# Altium project 2nd PCB.PrjPcb
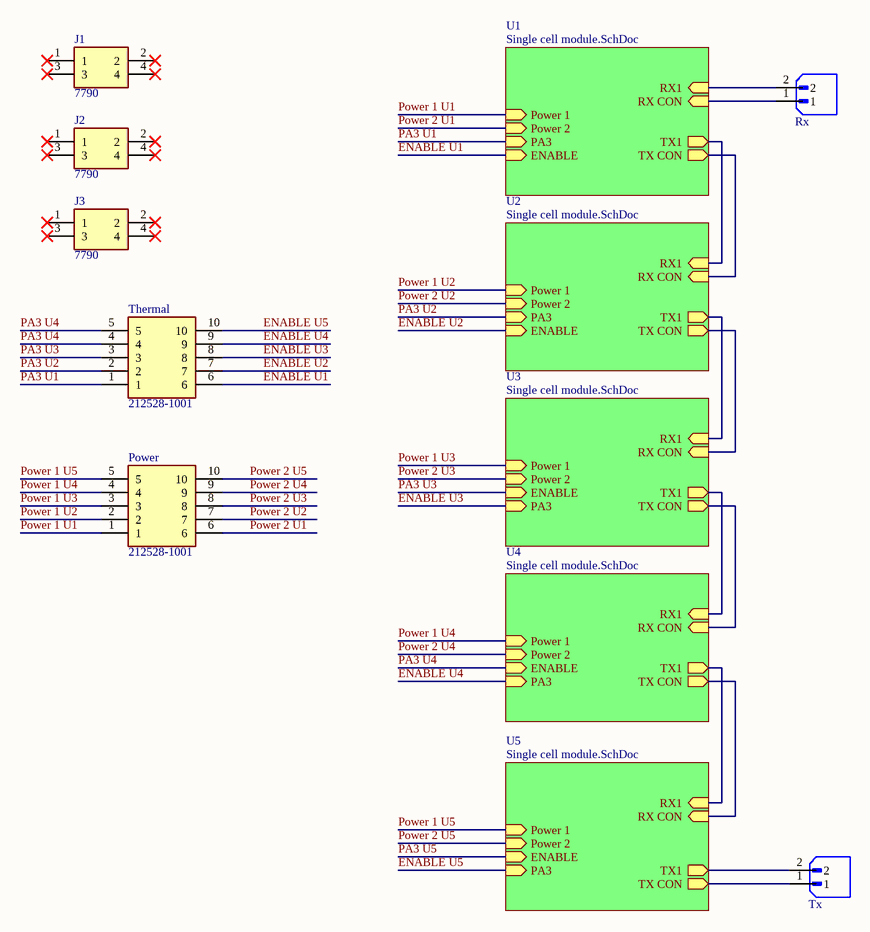
[diagram p0: Five cell modules.SchDoc]
2 sheets, 167 parts. Net scope: hierarchical (ports join the sheet entries above them; power ports are global).
Board file: PCB2.PcbDoc
Sheets:
  Five cell modules.SchDoc
    U3 = Single cell module.SchDoc
    U4 = Single cell module.SchDoc
    U5 = Single cell module.SchDoc
    U1 = Single cell module.SchDoc
    U2 = Single cell module.SchDoc

## Sheet Five cell modules.SchDoc
size A4; SheetNumber: 1; SheetTotal: 2

### Parts
J1  7790  [7790]
J2  7790  [7790]
J3  7790  [7790]
Power  212528-1001  [212528-10YY_1]
Rx  B2B-XH-A(LF)(SN)  [JST_B2B-XH-A(LF)(SN)]  (value not drawn)
Thermal  212528-1001  [212528-10YY_1]
Tx  B2B-XH-A(LF)(SN)  [JST_B2B-XH-A(LF)(SN)]  (value not drawn)

### Sub-sheets
U1 = Single cell module.SchDoc: TX1 (out), TX CON (out), RX1 (in), RX CON (in), Power 1 (in), Power 2 (in), PA3 (in), ENABLE (in)
U2 = Single cell module.SchDoc: TX1 (out), TX CON (out), RX1 (in), RX CON (in), Power 1 (in), Power 2 (in), PA3 (in), ENABLE (in)
U3 = Single cell module.SchDoc: TX1 (out), TX CON (out), RX1 (in), RX CON (in), Power 1 (in), Power 2 (in), ENABLE (in), PA3 (in)
U4 = Single cell module.SchDoc: TX1 (out), TX CON (out), RX1 (in), RX CON (in), Power 1 (in), Power 2 (in), ENABLE (in), PA3 (in)
U5 = Single cell module.SchDoc: TX1 (out), TX CON (out), RX1 (in), RX CON (in), Power 1 (in), Power 2 (in), ENABLE (in), PA3 (in)

### Nets
Power 1 U1: Power.1 Power.2 Power.3 Power.4 Power.5 ; sheet U3/Power 1, sheet U4/Power 1, sheet U5/Power 1, sheet U1/Power 1, sheet U2/Power 1  [also labelled Power 1 U2, Power 1 U3, Power 1 U4, Power 1 U5]
VCC: Rx.2 ; sheet U3/TX1, sheet U3/RX1, sheet U4/TX1, sheet U4/RX1, sheet U5/RX1, sheet U1/TX1, sheet U1/RX1, sheet U2/TX1, sheet U2/RX1
ENABLE U1: Thermal.6 ; sheet U1/ENABLE
ENABLE U2: Thermal.7 ; sheet U2/ENABLE
ENABLE U3: Thermal.8 ; sheet U3/PA3
ENABLE U4: Thermal.9 ; sheet U4/PA3
ENABLE U5: Thermal.10 ; sheet U5/PA3
PA3 U1: Thermal.1 ; sheet U1/PA3
PA3 U2: Thermal.2 ; sheet U2/PA3
PA3 U3: Thermal.3 ; sheet U3/ENABLE
PA3 U4: Thermal.4 Thermal.5 ; sheet U4/ENABLE
PA3 U5: sheet U5/ENABLE
Power 2 U1: Power.6 ; sheet U1/Power 2
Power 2 U2: Power.7 ; sheet U2/Power 2
Power 2 U3: Power.8 ; sheet U3/Power 2
Power 2 U4: Power.9 ; sheet U4/Power 2
Power 2 U5: Power.10 ; sheet U5/Power 2
RXDO: Rx.1 ; sheet U1/RX CON
RXDO: sheet U3/RX CON, sheet U2/TX CON  [a separate net that carries the same name]
RXDO: sheet U3/TX CON, sheet U4/RX CON  [a separate net that carries the same name]
RXDO: sheet U4/TX CON, sheet U5/RX CON  [a separate net that carries the same name]
RXDO: sheet U1/TX CON, sheet U2/RX CON  [a separate net that carries the same name]
NetTx_1: Tx.1 ; sheet U5/TX CON
NetTx_2: Tx.2 ; sheet U5/TX1

Not connected (* = marked no-connect by the designer): J1 1* 2* 3* 4*; J2 1* 2* 3* 4*; J3 1* 2* 3* 4*

### Library data of the parts
J1-J3 = 7790: Connector; Manufacturer_Name: Keystone Electronics; Datasheet Link: https://www.digikey.co.uk/product-detail/en/keystone-electronics/7790/36-7790-ND/2171010; Height: 7.9mm; Manufacturer_Part_Number: 7790; Mouser Part Number: 534-7790; Mouser Price/Stock: https://www.mouser.co.uk/ProductDetail/Keystone-Electronics/7790?qs=zBlGwAMnvtdjBTIaaitQnQ%3D%3D; Arrow Part Number: 7790; Arrow Price/Stock: https://www.arrow.com/en/products/7790/keystone-electronics?region=europe
Power Thermal = 212528-1001: Connector; Manufacturer_Name: Molex; Datasheet Link: https://www.molex.com/pdm_docs/sd/2125280200_sd.pdf; Height: 8.8mm; Manufacturer_Part_Number: 212528-1001; Mouser Part Number: 538-212528-1001; Mouser Price/Stock: https://www.mouser.co.uk/ProductDetail/Molex/212528-1001?qs=W%2FMpXkg%252BdQ4hWZ2b%252Bpt5GQ%3D%3D
Rx Tx = B2B-XH-A(LF)(SN): Connector Header Through Hole 2 position 0.098 (2.50mm); MF: JST Sales America Inc.; SnapEDA_Link: https://www.snapeda.com/parts/B2B-XH-A(LF)(SN)/JST+Sales+America+Inc./view-part/?ref=snap; Package: None; Value: *; MP: B2B-XH-A(LF)(SN); Check_prices: https://www.snapeda.com/parts/B2B-XH-A(LF)(SN)/JST+Sales+America+Inc./view-part/?ref=eda

## Sheet Single cell module.SchDoc
size A4; SheetNumber: 2; SheetTotal: 2
Used 5 times, as channels U3, U4, U5, U1, U2. Parts and nets are listed once, with the designators drawn on the sheet.
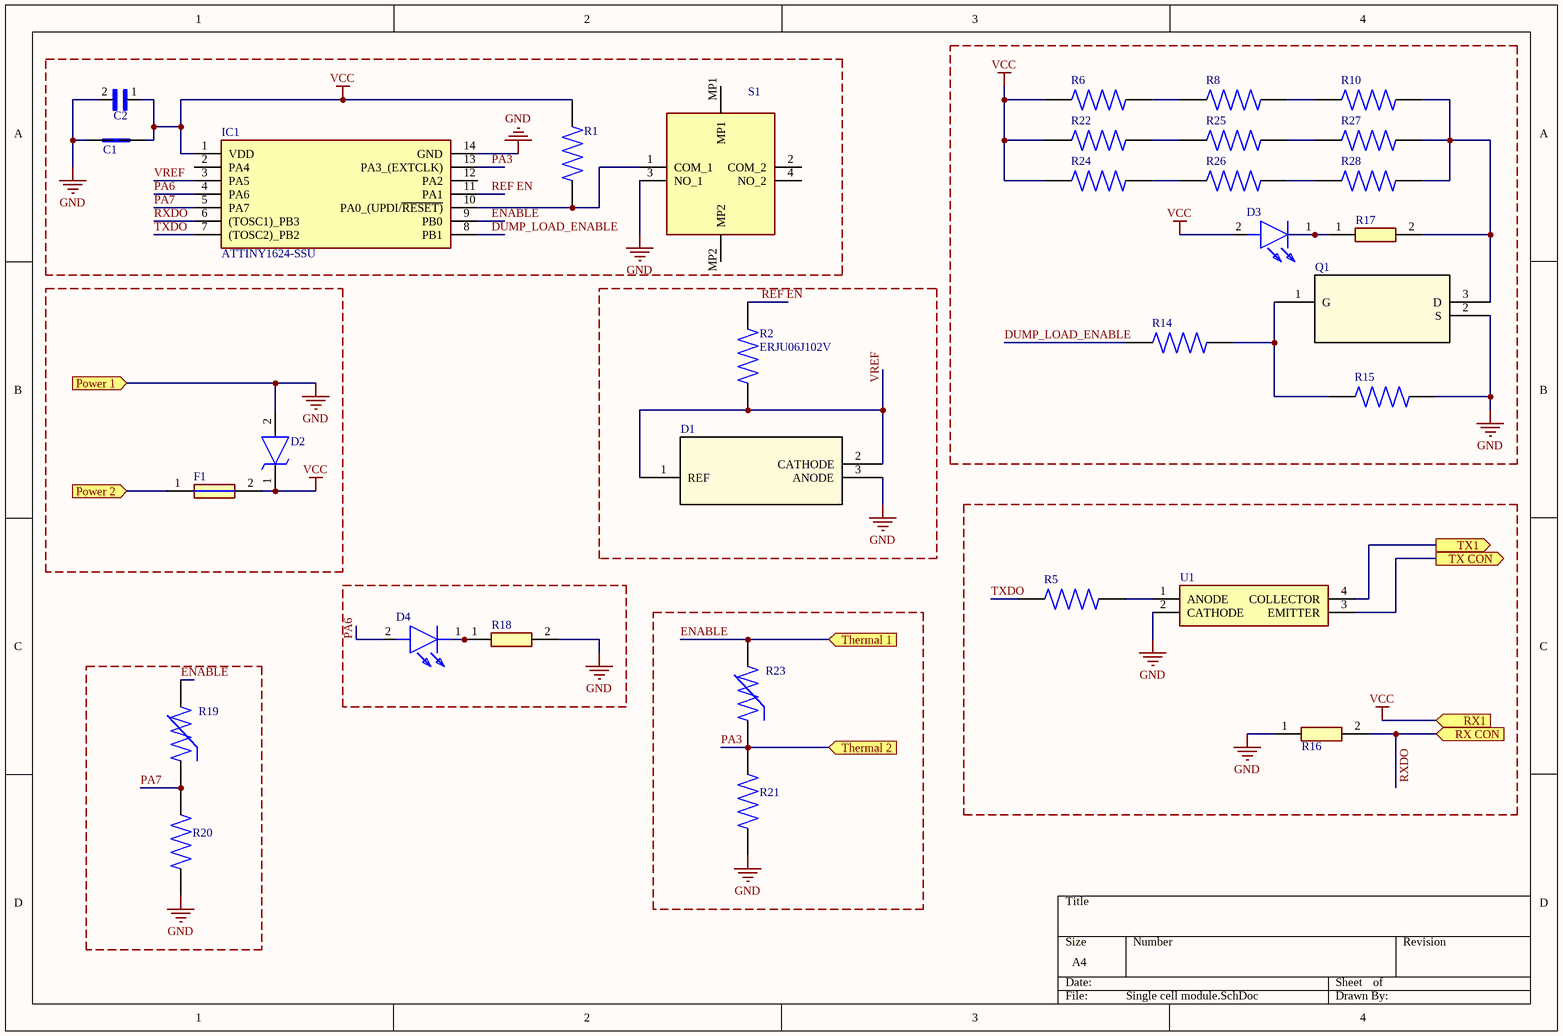
[diagram p1: Single cell module.SchDoc]

### Parts
C1  CC0805KRX7R9BB104  [CAPC2012X70]  (value not drawn)
C2  CL21A106KAYNNNE  [CAPC2012X135N]  (value not drawn)
D1  AZ432ANTR-E1  [SOT-23_DIO]  (value not drawn)
D2  SM6T6V8A  [DIOM5436X265N]  (value not drawn)
D3  19-217_GHC-YR1S2_3T  [LEDC1608X50N]  (value not drawn)
D4  19-217_GHC-YR1S2_3T  [LEDC1608X50N]  (value not drawn)
F1  MF-MSMF150-2  [FUSC4632X85N]  (value not drawn)
IC1  ATTINY1624-SSU  [SOIC127P600X175-14N]
Q1  AO3400A  [SOT-23-3L_AOS]  (value not drawn)
R1  ERA6ARW104V  [RES_ERA6ARW104V]  (value not drawn)
R2  ERJU06J102V  [RES_ERJU06J102V]
R5  ERJ6ENF1800V  [RES_ERJ6ENF1800V]  (value not drawn)
R6  ERA6ARW104V  [RES_ERA6ARW104V]  (value not drawn)
R8  ERA6ARW104V  [RES_ERA6ARW104V]  (value not drawn)
R10  ERA6ARW104V  [RES_ERA6ARW104V]  (value not drawn)
R14  RT1206DRD07510RL  [RESC3116X65N]  (value not drawn)
R15  ERJP06D1002V  [RES_ERJP06D1002V]  (value not drawn)
R16  0805W8F2201T5E  [RESC2013X65N]  (value not drawn)
R17  0805W8F2201T5E  [RESC2013X65N]  (value not drawn)
R18  0805W8F2201T5E  [RESC2013X65N]  (value not drawn)
R19  NCP18WF104J03RB  [THRMC1608X95N]  (value not drawn)
R20  ERJP06D1002V  [RES_ERJP06D1002V]  (value not drawn)
R21  ERJP06D1002V  [RES_ERJP06D1002V]  (value not drawn)
R22  ERA6ARW104V  [RES_ERA6ARW104V]  (value not drawn)
R23  NCP18WF104J03RB  [THRMC1608X95N]  (value not drawn)
R24  ERA6ARW104V  [RES_ERA6ARW104V]  (value not drawn)
R25  ERA6ARW104V  [RES_ERA6ARW104V]  (value not drawn)
R26  ERA6ARW104V  [RES_ERA6ARW104V]  (value not drawn)
R27  ERA6ARW104V  [RES_ERA6ARW104V]  (value not drawn)
R28  ERA6ARW104V  [RES_ERA6ARW104V]  (value not drawn)
S1  TS21-34-035-BK-160-SMT-TR  [TS2134035BK160SMTTR]  (value not drawn)
U1  EL3H7_B__TA_-G  [SOIC127P700X200-4N]  (value not drawn)

### Ports
Power 1 (in), Power 2 (in), RX1 (in), RX CON (in), Thermal 1 (in), Thermal 2 (in), TX1 (out), TX CON (out)

### Nets
GND: C1.1 C2.2 D1.3(ANODE) D2.2(A) IC1.14(GND) Q1.2(S) R15.2 R16.1 R18.2 R20.1 R21.1 S1.3(NO_1) U1.2(CATHODE) ; port Power 1
VCC: C1.2 C2.1 D2.1(K) D3.2(A) F1.2 IC1.1(VDD) R1.2 R6.1 R22.1 R24.1 ; port RX1
DUMP_LOAD_ENABLE: IC1.8(PB1) R14.1
ENABLE: IC1.9(PB0) R19.2 R23.2 ; port Thermal 1
PA3: IC1.13(PA3_(EXTCLK)) R21.2 R23.1 ; port Thermal 2
PA6: D4.2(A) IC1.4(PA6)
PA7: IC1.5(PA7) R19.1 R20.2
Power 2: F1.1 ; port Power 2
REF EN: IC1.11(PA1) R2.2
RXDO: IC1.6((TOSC1)_PB3) R16.2 ; port RX CON
TX1: U1.4(COLLECTOR) ; port TX1
TX CON: U1.3(EMITTER) ; port TX CON
TXDO: IC1.7((TOSC2)_PB2) R5.1
VREF: D1.1(REF) D1.2(CATHODE) IC1.3(PA5) R2.1
NetD3_1: D3.1(K) R17.1
NetD4_1: D4.1(K) R18.1
NetIC1_10: IC1.10(PA0_(UPDI/~{RESET)}) R1.1 S1.1(COM_1)
NetQ1_1: Q1.1(G) R14.2 R15.1
NetQ1_3: Q1.3(D) R10.2 R17.2 R27.2 R28.2
NetR5_2: R5.2 U1.1(ANODE)
NetR6_2: R6.2 R8.1
NetR8_2: R8.2 R10.1
NetR22_2: R22.2 R25.1
NetR24_2: R24.2 R26.1
NetR25_2: R25.2 R27.1
NetR26_2: R26.2 R28.1

Not connected (* = marked no-connect by the designer): IC1 2(PA4) 12(PA2); S1 2(COM_2) 4(NO_2) MP1 MP2

### Channels
U3: designators end in _U3; ports Power 1=Power 1 U1 Power 2=Power 2 U3 RX1=VCC RX CON=RXDO Thermal 1=ENABLE_U3 Thermal 2=PA3_U3 TX1=VCC TX CON=RXDO
U4: designators end in _U4; ports Power 1=Power 1 U1 Power 2=Power 2 U4 RX1=VCC RX CON=RXDO Thermal 1=ENABLE_U4 Thermal 2=PA3_U4 TX1=VCC TX CON=RXDO
U5: designators end in _U5; ports Power 1=Power 1 U1 Power 2=Power 2 U5 RX1=VCC RX CON=RXDO Thermal 1=ENABLE_U5 Thermal 2=PA3_U5 TX1=NetTx_2 TX CON=NetTx_1
U1: designators end in _U1; ports Power 1=Power 1 U1 Power 2=Power 2 U1 RX1=VCC RX CON=RXDO Thermal 1=ENABLE_U1 Thermal 2=PA3_U1 TX1=VCC TX CON=RXDO
U2: designators end in _U2; ports Power 1=Power 1 U1 Power 2=Power 2 U2 RX1=VCC RX CON=RXDO Thermal 1=ENABLE_U2 Thermal 2=PA3_U2 TX1=VCC TX CON=RXDO

### Library data of the parts
C1 = CC0805KRX7R9BB104: 0.1ÂµF Â±10% 50V Ceramic Capacitor X7R 0805 _2012 Metric_; MF: Yageo; Value: *; Availability: Unavailable; SnapEDA_Link: https://www.snapeda.com/parts/CC0805KRX7R9BB104/Yageo/view-part/105548/?ref=snap; Package: 0805 Yageo; MP: CC0805KRX7R9BB104; Price: None
C2 = CL21A106KAYNNNE: 10ÂµF Â±10% 25V Ceramic Capacitor X5R 0805 (2012 Metric); MF: Samsung; Value: *; Check_prices: https://www.snapeda.com/parts/CL21A106KAYNNNE/Samsung/view-part/3598482/?ref=eda; Package: 0805 Samsung; SnapEDA_Link: https://www.snapeda.com/parts/CL21A106KAYNNNE/Samsung/view-part/3598482/?ref=snap; MP: CL21A106KAYNNNE; Digi-Key_Part_Number: 1276-2891-1-ND
D1 = AZ432ANTR-E1: No Description Available; Mfr_Name: Diodes Inc; RefDes: RefDes; Type: Type
D2 = SM6T6V8A: TVS Diode (Uni-directional); Manufacturer_Name: STMicroelectronics; Datasheet Link: https://www.st.com/resource/en/datasheet/sm6t100a.pdf; Height: 2.65mm; Manufacturer_Part_Number: SM6T6V8A; Mouser Part Number: 511-SM6T6V8A; Mouser Price/Stock: https://www.mouser.co.uk/ProductDetail/STMicroelectronics/SM6T6V8A?qs=gFQxgRPje42DFJYRsrsouA%3D%3D; Arrow Part Number: SM6T6V8A; Arrow Price/Stock: https://www.arrow.com/en/products/sm6t6v8a/stmicroelectronics?region=nac
D3 D4 = 19-217_GHC-YR1S2_3T: LED; Manufacturer_Name: Everlight; Manufacturer_Part_Number: 19-217/GHC-YR1S2/3T; Datasheet Link: https://www.mouser.co.uk/datasheet/2/143/19-217-GHC-YR1S2-3T-1663276.pdf; Height: 0.5mm; Mouser Part Number: 638-19217GHCYR1S23T; Mouser Price/Stock: https://www.mouser.co.uk/ProductDetail/Everlight/19-217-GHC-YR1S2-3T?qs=8cKuZ6Ok2lZjmFTUzVFjDg%3D%3D; Arrow Part Number: 19-217/GHC-YR1S2/3T; Arrow Price/Stock: https://www.arrow.com/en/products/19-217ghc-yr1s23t/everlight-electronics
F1 = MF-MSMF150-2: Fuse; Manufacturer_Name: Bourns; Datasheet Link: https://componentsearchengine.com/Datasheets/2/MF-MSMF150-2.pdf; Height: 0.85mm; Manufacturer_Part_Number: MF-MSMF150-2; Mouser Part Number: 652-MF-MSMF150-2; Mouser Price/Stock: https://www.mouser.co.uk/ProductDetail/Bourns/MF-MSMF150-2?qs=VJkZAnU6DY2RTCSZT8Bxqg%3D%3D; Arrow Part Number: MF-MSMF150-2; Arrow Price/Stock: https://www.arrow.com/en/products/mf-msmf150-2/bourns?region=nac
IC1 = ATTINY1624-SSU: Integrated Circuit; Manufacturer_Name: Microchip; Datasheet Link: https://ww1.microchip.com/downloads/en/DeviceDoc/ATtiny1624-26-27-DataSheet-DS40002234A.pdf; Height: 1.75mm; Manufacturer_Part_Number: ATTINY1624-SSU; Mouser Part Number: 556-ATTINY1624-SSU; Mouser Price/Stock: https://www.mouser.co.uk/ProductDetail/Microchip-Technology/ATTINY1624-SSU?qs=vmHwEFxEFR%2FHKYGUmUC%2Fzw%3D%3D; Arrow Part Number: ATTINY1624-SSU; Arrow Price/Stock: https://www.arrow.com/en/products/attiny1624-ssu/microchip-technology?region=nac
Q1 = AO3400A: No Description Available; Mfr_Name: Alpha and Omega Semiconductor; RefDes: RefDes; Type: Type
R14 = RT1206DRD07510RL: RES SMD 510 OHM 0.5% 1/8W 1206; Package: None; Price: None; Value: *; MP: RT1206DRD07510RL; Availability: Unavailable
R16-R18 = 0805W8F2201T5E: Resistor; Manufacturer_Name: ROYALOHM; Datasheet Link: https://www.mouser.fr/datasheet/2/1365/GeneralPurpose-2498088.pdf; Height: 0.65mm; Manufacturer_Part_Number: 0805W8F2201T5E; Mouser Part Number: 303-0805W8F2201T5E; Mouser Price/Stock: https://www.mouser.co.uk/ProductDetail/Royalohm/0805W8F2201T5E?qs=e8oIoAS2J1RJNRSZp0Nryw%3D%3D
R19 R23 = NCP18WF104J03RB: NTC Thermistor 100k 0603 (1608 Metric); MF: Murata Electronics; Package: 1608 Murata; Check_prices: https://www.snapeda.com/parts/NCP18WF104J03RB/Murata%20Electronics%20North%20America/view-part/144301/?ref=eda; Value: *; Purchase-URL: https://pricing.snapeda.com/search/part/NCP18WF104J03RB/?ref=eda; SnapEDA_Link: https://www.snapeda.com/parts/NCP18WF104J03RB/Murata%20Electronics%20North%20America/view-part/144301/?ref=snap; Availability: Good; MP: NCP18WF104J03RB; Price: None
S1 = TS21-34-035-BK-160-SMT-TR: Switch; Manufacturer_Name: CUI Devices; Datasheet Link: https://www.cuidevices.com/product/resource/ts21.pdf; Height: 1.7mm; Manufacturer_Part_Number: TS21-34-035-BK-160-SMT-TR; Mouser Part Number: 179-134035BK160SMTTR; Mouser Price/Stock: https://www.mouser.co.uk/ProductDetail/CUI-Devices/TS21-34-035-BK-160-SMT-TR?qs=1Kr7Jg1SGW9zzGN58LP5Sg%3D%3D
U1 = EL3H7_B__TA_-G: Integrated Circuit; Manufacturer_Name: Everlight; Manufacturer_Part_Number: EL3H7(B)(TA)-G; Datasheet Link: https://www.arrow.com/en/products/el3h7-b-ta-g/everlight-electronics?region=nac; Height: 2mm; Mouser Part Number: 638-EL3H7BTAG; Mouser Price/Stock: https://www.mouser.co.uk/ProductDetail/Everlight/EL3H7BTA-G?qs=8PzhAHr7IdM%252B0XGOXhFFCg%3D%3D; Arrow Part Number: EL3H7(B)(TA)-G; Arrow Price/Stock: https://www.arrow.com/en/products/el3h7-b-ta-g/everlight-electronics?region=nac
R1 R6 R8 R10 R22 R24-R28 = ERA6ARW104V: Value: *; Package: None; MP: ERA6ARW104V; Availability: Unavailable; Price: None
R2 = ERJU06J102V: Availability: Unavailable; Value: *; Price: None; MP: ERJU06J102V; Package: None
R5 = ERJ6ENF1800V: Value: *; Availability: Unavailable; Price: None; MP: ERJ6ENF1800V; Package: None
R15 R20 R21 = ERJP06D1002V: Price: None; Value: *; MP: ERJP06D1002V; Package: None; Availability: Unavailable

## Nets that join several sheets
Power 1 U1: Five cell modules (5 pins), U3 (13 pins), U4 (13 pins), U5 (13 pins), U1 (13 pins), U2 (13 pins)
VCC: Five cell modules (Rx.2), U3 (11 pins), U4 (11 pins), U5 (10 pins), U1 (11 pins), U2 (11 pins)
NetTx_1: Five cell modules (Tx.1), U5 (U1_U5.3)
NetTx_2: Five cell modules (Tx.2), U5 (U1_U5.4)
Power 2 U1: Five cell modules (Power.6), U1 (F1_U1.1)
Power 2 U2: Five cell modules (Power.7), U2 (F1_U2.1)
Power 2 U3: Five cell modules (Power.8), U3 (F1_U3.1)
Power 2 U4: Five cell modules (Power.9), U4 (F1_U4.1)
Power 2 U5: Five cell modules (Power.10), U5 (F1_U5.1)
RXDO: Five cell modules (Rx.1), U1 (IC1_U1.6 R16_U1.2)
RXDO: U3 (IC1_U3.6 R16_U3.2), U2 (U1_U2.3)
RXDO: U3 (U1_U3.3), U4 (IC1_U4.6 R16_U4.2)
RXDO: U4 (U1_U4.3), U5 (IC1_U5.6 R16_U5.2)
RXDO: U1 (U1_U1.3), U2 (IC1_U2.6 R16_U2.2)